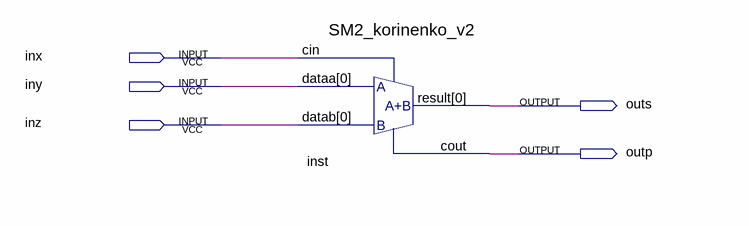
[diagram p0: schematic sheet]
// Quartus schematic Lab2_SM_korinenko_v2.bdf as structural Verilog: 1 symbols, 5 pins
module Lab2_SM_korinenko_v2 (
  input  inx,
  input  iny,
  input  inz,
  output outs,
  output outp
);

  SM2_korinenko_v2 inst (.dataa(iny), .datab(inz), .cin(inx), .result(outs), .cout(outp));
endmodule
